# Altium schematic sheet v12.SchDoc
size A1; Organization: Protel International P/L; Address1: L3, 12a Rodborough Rd; Address2: Frenchs Forest; Address3: NSW; Address4: Australia 2086
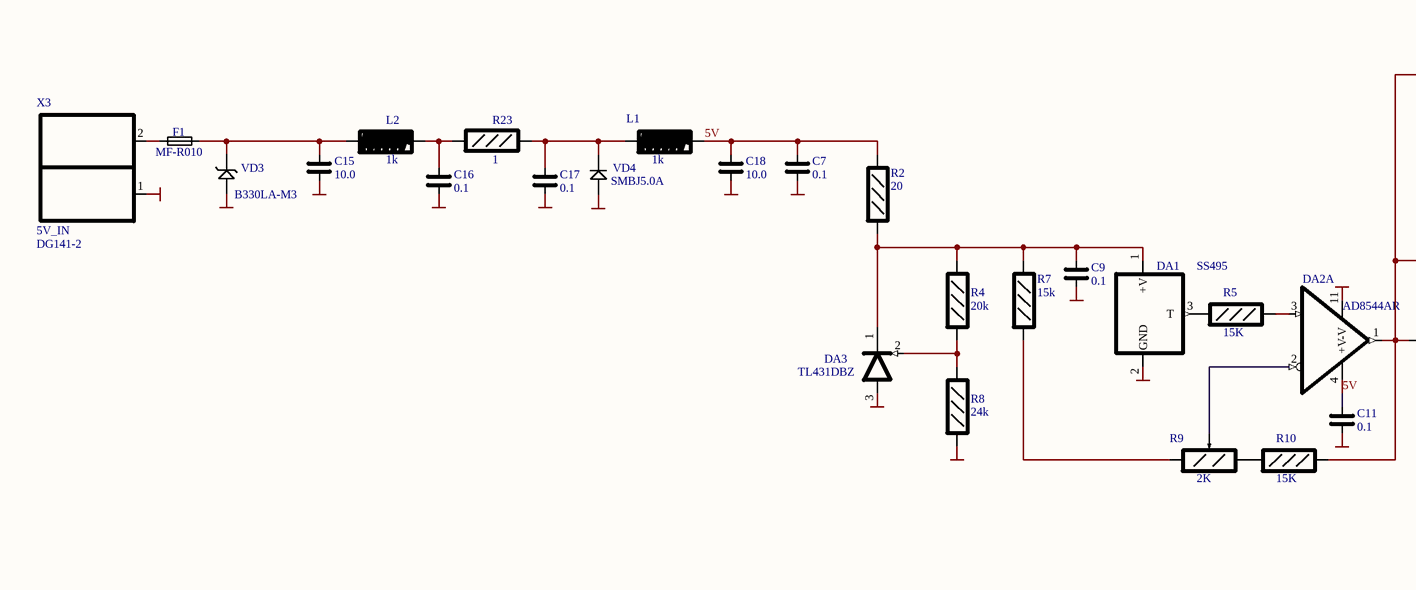
[diagram p0: v12.SchDoc, left]
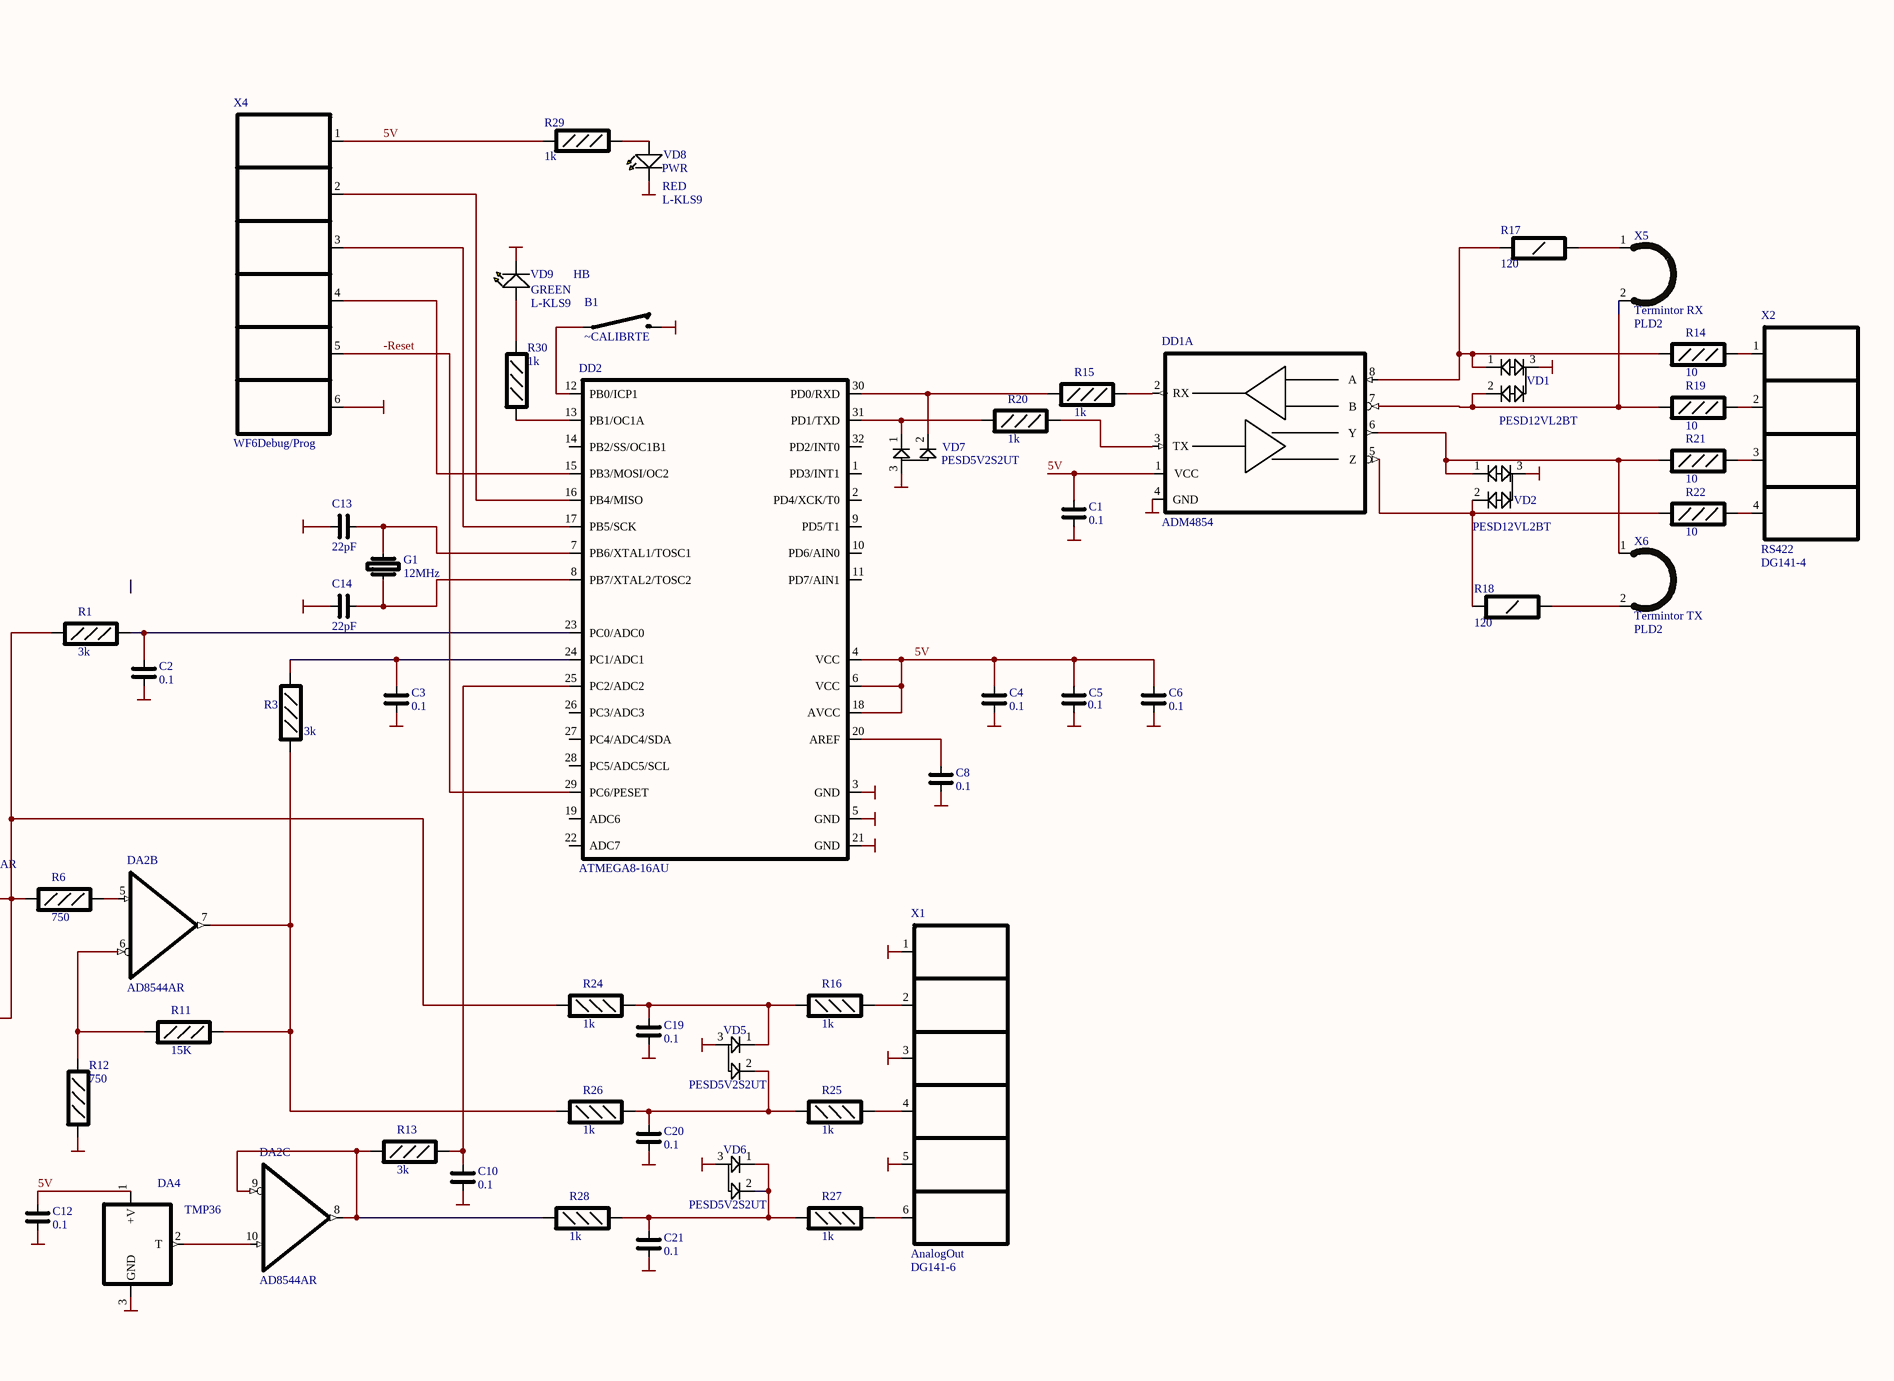
[diagram p1: v12.SchDoc, right]

## Parts
B1  ~CALIBRTE  [DIP_4-450_PB_OMRON_B3F-1070]
C1  0.1  [CAPC1608X85N]
C2  0.1  [CAPC1608X85N]
C3  0.1  [CAPC1608X85N]
C4  0.1  [CAPC1608X85N]
C5  0.1  [CAPC1608X85N]
C6  0.1  [CAPC1608X85N]
C7  0.1  [CAPC1608X85N]
C8  0.1  [CAPC1608X85N]
C9  0.1  [CAPC1608X85N]
C10  0.1  [CAPC1608X85N]
C11  0.1  [CAPC1608X85N]
C12  0.1  [CAPC1608X85N]
C13  22pF  [CAPC1608X85N]
C14  22pF  [CAPC1608X85N]
C15  10.0  [CAPC3216X152N]
C16  0.1  [CAPC1608X85N]
C17  0.1  [CAPC1608X85N]
C18  10.0  [CAPC3216X152N]
C19  0.1  [CAPC1608X85N]
C20  0.1  [CAPC1608X85N]
C21  0.1  [CAPC1608X85N]
DA1  SS495  [TO92H_3-127L - spec1]
DA2  AD8544AR  [SOIC_14-127]  (parts A,B,C of 4)
DA3  TL431DBZ  [SOT23-95]
DA4  TMP36  [TO-92AA-P127]
DD1  ADM4854  [SOIC8]  (part A of 3)
DD2  ATMEGA8-16AU  [TQFP_32-80]
F1  MF-R010  [MF-R-508]
G1  12MHz  [XTAL_HC-49/U]
L1  1k  [RESC2012X50N]
L2  1k  [RESC2012X50N]
R1  3k  [RESC1608X50N]
R2  20  [RESC1608X50N]
R3  3k  [RESC1608X50N]
R4  20k  [RESC1608X50N]
R5  15K  [RESC1608X50N]
R6  750  [RESC1608X50N]
R7  15k  [RESC1608X50N]
R8  24k  [RESC1608X50N]
R9  2K  [TRIM_BOURNS_3296Y]
R10  15K  [RESC1608X50N]
R11  15K  [RESC1608X50N]
R12  750  [RESC1608X50N]
R13  3k  [RESC1608X50N]
R14  10  [RESC1608X50N]
R15  1k  [RESC1608X50N]
R16  1k  [RESC1608X50N]
R17  120  [RESC3216X65N]
R18  120  [RESC3216X65N]
R19  10  [RESC1608X50N]
R20  1k  [RESC1608X50N]
R21  10  [RESC1608X50N]
R22  10  [RESC1608X50N]
R23  1  [RESC1608X50N]
R24  1k  [RESC1608X50N]
R25  1k  [RESC1608X50N]
R26  1k  [RESC1608X50N]
R27  1k  [RESC1608X50N]
R28  1k  [RESC1608X50N]
R29  1k  [RESC1608X50N]
R30  1k  [RESC1608X50N]
VD1  PESD12VL2BT  [SO23-95]
VD2  PESD12VL2BT  [SO23-95]
VD3  B330LA-M3  [DO214]
VD4  SMBJ5.0A  [DO214]
VD5  PESD5V2S2UT  [SO23-95]
VD6  PESD5V2S2UT  [SO23-95]
VD7  PESD5V2S2UT  [SO23-95]
VD8  PWR  Color: RED  Device: L-KLS9  [LED0603]
VD9  HB  Color: GREEN  Device: L-KLS9  [LED0603]
X1  AnalogOut  [DIP_CLEMM_6-254_F]
X2  RS422  [DIP_CLEMM_4-254_F]
X3  5V_IN  [DIP_CLEMM_2-254_F]
X4  WF6Debug/Prog  [SIP_6-254]
X5  Termintor RX  [DIP_2-254_WO_CASE]
X6  Termintor TX  [DIP_2-254_WO_CASE]

## Nets
GND: B1.2 C1.1 C2.1 C3.1 C4.1 C5.1 C6.1 C7.1 C8.1 C9.1 C10.1 C11.1 C12.1 C13.1 C14.1 C15.1 C16.1 C17.1 C18.1 C19.1 C20.1 C21.1 DA1.2(GND) DA2.11(-V) DA3.3(A) DA4.3(GND) DD1.4(GND) DD2.3(GND) DD2.5(GND) DD2.21(GND) R8.1 R12.1 VD1.3(CAT_COM) VD2.3(CAT_COM) VD3.2(A) VD4.2(A) VD5.3(CAT_COM) VD6.3(CAT_COM) VD7.3(CAT_COM) VD8.1(C) VD9.1(C) X1.1 X1.3 X1.5 X3.1 X4.6
5V: C1.2 C4.2 C5.2 C6.2 C7.2 C11.2 C12.2 C18.2 DA2.4(+V) DA4.1(+V) DD1.1(VCC) DD2.4(VCC) DD2.6(VCC) DD2.18(AVCC) L1.2 R2.2 R29.2 X4.1
-Reset: DD2.29(PC6/PESET) X4.5
NetB1_1: B1.1 DD2.12(PB0/ICP1)
NetC2_2: C2.2 DD2.23(PC0/ADC0) R1.2
NetC3_2: C3.2 DD2.24(PC1/ADC1) R3.2
NetC8_2: C8.2 DD2.20(AREF)
NetC9_2: C9.2 DA1.1(+V) DA3.1(C) R2.1 R4.2 R7.2
NetC10_2: C10.2 DD2.25(PC2/ADC2) R13.2
NetC13_2: C13.2 DD2.7(PB6/XTAL1/TOSC1) G1.2
NetC14_2: C14.2 DD2.8(PB7/XTAL2/TOSC2) G1.1
NetC15_2: C15.2 F1.2 L2.1 VD3.1(C)
NetC16_2: C16.2 L2.2 R23.2
NetC17_2: C17.2 L1.1 R23.1 VD4.1(C)
NetC19_2: C19.2 R16.2 R24.1 VD5.1(C1)
NetC20_2: C20.2 R25.2 R26.1 VD5.2(C2)
NetC21_2: C21.2 R27.2 R28.1 VD6.1(C1) VD6.2(C2)
NetDA1_3: DA1.3(T) R5.1
NetDA2_1: DA2.1(OUT) R1.1 R6.1 R10.2 R24.2
NetDA2_2: DA2.2(-IN) R9.3
NetDA2_3: DA2.3(+IN) R5.2
NetDA2_5: DA2.5(+IN) R6.2
NetDA2_6: DA2.6(-IN) R11.1 R12.2
NetDA2_7: DA2.7(OUT) R3.1 R11.2 R26.2
NetDA2_8: DA2.8(OUT) DA2.9(-IN) R13.1 R28.2
NetDA2_10: DA2.10(+IN) DA4.2(T)
NetDA3_2: DA3.2(Ref) R4.1 R8.2
NetDD1_2: DD1.2(RX) R15.2
NetDD1_3: DD1.3(TX) R20.2
NetDD1_5: DD1.5(Z) R18.1 R22.1 VD2.2(C2)
NetDD1_6: DD1.6(Y) R21.1 VD2.1(C1) X6.1
NetDD1_7: DD1.7(B) R19.1 VD1.2(C2) X5.2
NetDD1_8: DD1.8(A) R14.1 R17.1 VD1.1(C1)
NetDD2_13: DD2.13(PB1/OC1A) R30.1
NetDD2_15: DD2.15(PB3/MOSI/OC2) X4.4
NetDD2_16: DD2.16(PB4/MISO) X4.2
NetDD2_17: DD2.17(PB5/SCK) X4.3
NetDD2_30: DD2.30(PD0/RXD) R15.1 VD7.2(C2)
NetDD2_31: DD2.31(PD1/TXD) R20.1 VD7.1(C1)
NetF1_1: F1.1 X3.2
NetR7_1: R7.1 R9.1
NetR9_2: R9.2 R10.1
NetR14_2: R14.2 X2.1
NetR16_1: R16.1 X1.2
NetR17_2: R17.2 X5.1
NetR18_2: R18.2 X6.2
NetR19_2: R19.2 X2.2
NetR21_2: R21.2 X2.3
NetR22_2: R22.2 X2.4
NetR25_1: R25.1 X1.4
NetR27_1: R27.1 X1.6
NetR29_1: R29.1 VD8.2(A)
NetR30_2: R30.2 VD9.2(A)

Not connected (* = marked no-connect by the designer): DD2 1(PD3/INT1) 2(PD4/XCK/T0) 9(PD5/T1) 10(PD6/AIN0) 11(PD7/AIN1) 14(PB2/SS/OC1B1) 19(ADC6) 22(ADC7) 26(PC3/ADC3) 27(PC4/ADC4/SDA) 28(PC5/ADC5/SCL) 32(PD2/INT0)

## Notes on the sheet
- Title
- Size:
- Date:
- File:
- A1
- Number:
- Time:
- Revision:
- Sheet
- of

## Library data of the parts
B1 = PushBt: Push button wo latch; Vendor: Vishay; Unit Price: 0.1; Package: DIP4-450; Value: ~CALIBRTE
C1-C12 C16 C17 C19-C21 = CAP00603: Chip capasitor 0603; Group: Passive; Vendor: Vishay; Unit Price: 0.1; Descr: Chip capasitor 0603; Package: 0603; Value: 0.1
C13 C14 = CAP00603: Chip capasitor 0603; Vendor: Vishay; Unit Price: 0.1; Package: 0603; Value: 22pF
C15 C18 = CAP1206: Chip capasitor 1206; Vendor: Vishay; Unit Price: 0.1; Package: SMD1206; Value: 10.0
DA1 = SS495: 10mV / C Temperature sensor; Vendor: Honeywell; Package: TO92-H-spec1; Unit Price: 3; Device: SS495
DA2 = AD8544AR: Quad rail to rail i&O OpAmp. 2V7-5V 5 Single power supply. MOSFET in. SOIC14 Package; Vendor: Analog Devices Inc; Unit Price: 0.2; PPackage: SOIC14; Device: AD8544AR
DA3 = TL431DBZ: Adjustable voltage reference; Vendor: TI; Package: SOT23; Unit Price: 1; Device: TL431DBZ
DA4 = TMP36v: 10mV / C Temperature sensor; Vendor: Analog Devices inc.; Package: TO92-V; Unit Price: 1; Device: TMP36
DD1 = ADM4854: Full Duplex RS-422 Transceivers; Vendor: Analog Devices Inc; Device: ADM4854; Package: SOIC8; Unit Price: 1
DD2 = ATMEGA8-16AU: 8bit uController
F1 = MF-R-0: Fuse; Vendor: Bourns; Paccage: SIP_2-508; Device: MF-R0; Value: 10; Unit Price: 0,3
G1 = HC49U: Quartz resonator; Vendor: Vishay; Unit Price: 0.5; Package: XTAL-HC49; Value: 12MHz
L1 L2 = BLM21: SMD Ferrite bead 0805; Vendor: Vishay; Unit Price: 0.1; Device: BLM21; Package: SMD0805; Value: 1k
R1-R8 R10-R16 R19-R30 = Res0603: Chip resistor 0603; Group: Passive; Vendor: Vishay; Unit Price: 0.005; Descr: Chip resistor 0603; Package: SMD0603
  R1 R3 R13: Value: 3k
  R2: Value: 20
  R4: Value: 20k
  R5 R10 R11: Value: 15K
  R6 R12: Value: 750
  R7: Value: 15k
  R8: Value: 24k
  R14 R19 R21 R22: Value: 10
  R15 R16 R20 R24-R30: Value: 1k
  R23: Value: 1
R9 = 3296: Trimm Resistor; Descr: Chip resistor 0805; Group: Passive; Vendor: BOURNS; Unit Price: 0.2; Package: Trimm3296; Value: 2K
R17 R18 = Res1206: Chip resistor 1206; Vendor: Vishay; Unit Price: 0.005; Package: SMD1206; Value: 120
VD1 VD2 = PESDxxL2BT: Low capacitance double bidirectional ESD protection diodes in SOT23; Vendor: NXP; Device: PESD; Value: 12V; Package: SOT23; Unit Price: 0.5
VD3 = B330LA-M3: 3A 40V Schottky Diode; Vendor: Vishay; Package: DO214; Unit Price: 0.2; Device: B330LA-M3
VD4 = SMBJxxA: TVS surface mount diode; Vendor: Littelfuse; Device: SMBJ; Value: 5.0; Package: DO214; Unit Price: 1
VD5-VD7 = PESDxxS2UT: Low capacitance double  ESD protection diodes in SOT23; Vendor: NXP; Device: PESD; Value: 5V2; Package: SOT23; Unit Price: 0.5
VD8 VD9 = L-KLS9-T0603: Chip LED SMD 0603; Vendor: NINGBO KLS ELECTRONIC CO LTD; Package: SMD0603; Unit Price: 0.1
  VD8: Value: PWR
  VD9: Value: HB
X1 = DG141-6: 6 pin terminal spring clamp 2.54mm pitch; Vendor: Degson; Pckage: DIP6- 2.54x5.12; Unit Price: 0.6; Value: AnalogOut; Device: DG141-6
X2 = DG141-4: 4 pin terminal spring clamp 2.54mm pitch; Vendor: DEGSON; Pckage: DIP- 2.54x5.12; Unit Price: 0.4; Value: RS422; Device: DG141-4
X3 = DG141-2: 2 pin terminal spring clamp 2.54mm pitch; Vendor: DEGSON; Pckage: DIP- 2.54x5.12; Unit Price: 0.2; Value: 5V_IN; Device: DG141-2
X4 = WF6: 6 pin TRH connector 2.54mm pitch; Vendor: Connfly; Pckage: SIP_6- 2.54; Unit Price: 0.2; Value: Debug/Prog; Device: WF6
X5 X6 = PLD2: 2 pin TRH connector 2.54mm pitch; Vendor: Connfly; Pckage: DIP2- 2.54; Unit Price: 0.2; Device: PLD2
  X5: Value: Termintor RX
  X6: Value: Termintor TX